# Altium schematic sheet USB2UART.SchDoc
size A4
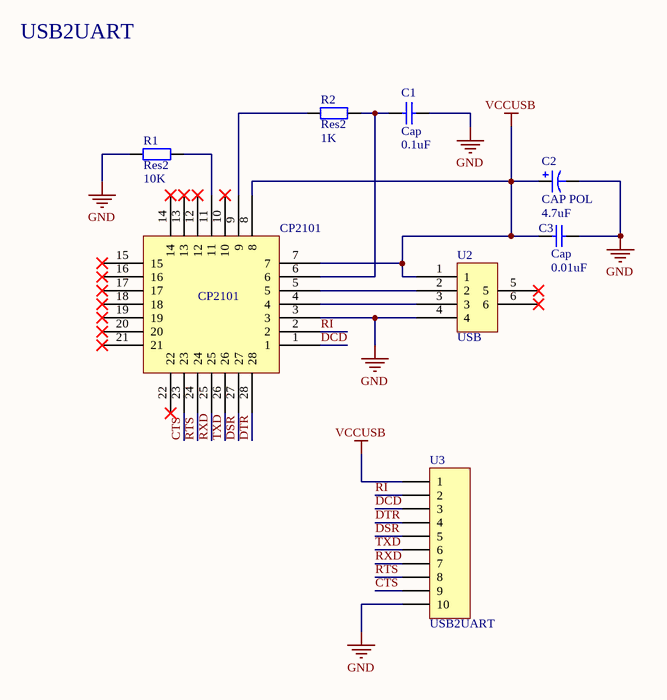
[diagram p0: USB2UART.SchDoc]

## Parts
?  CP2101
C1  Cap  value 0.1uF  [RAD-0.3]
C2  CAP POL  value 4.7uF  [CAP-LED]
C3  Cap  value 0.01uF  [RAD-0.3]
R1  Res2  value 10K  [AXIAL-0.4]
R2  Res2  value 1K  [AXIAL-0.4]
U2  USB
U3  USB2UART  [HDR1X10]

## Nets
GND: ?.3 C1.2 C2.2 C3.2 R1.1 U2.4 U3.10
VCCUSB: ?.7 ?.8 C2.1 C3.1 U2.1 U3.1
CTS: ?.23 U3.9
DCD: ?.1 U3.3
DSR: ?.27 U3.5
DTR: ?.28 U3.4
RI: ?.2 U3.2
RTS: ?.24 U3.8
RXD: ?.25 U3.7
TXD: ?.26 U3.6
Net?_4: ?.4 U2.3
Net?_5: ?.5 U2.2
Net?_6: ?.6 C1.1 R2.2
Net?_9: ?.9 R2.1
Net?_11: ?.11 R1.2

Not connected (* = marked no-connect by the designer): ? 10* 12* 13* 14* 15* 16* 17* 18* 19* 20* 21* 22*; U2 5* 6*

## Notes on the sheet
- USB2UART

## Library data of the parts
? = Component_1
C1 C3 = Cap: Capacitor; Published: 8-Jun-2000; LatestRevisionDate: 17-Jul-2002; LatestRevisionNote: Re-released for DXP Platform.; PackageReference: RAD-0.3; Publisher: Altium Limited
C2 = CAP POL: Polarized Capacitor (Axial); Published: 8-Jun-2000; LatestRevisionDate: 17-Jul-2002; LatestRevisionNote: Re-released for DXP Platform.; Publisher: Altium Limited
R1 R2 = Res2: Resistor; Published: 8-Jun-2000; LatestRevisionDate: 17-Jul-2002; LatestRevisionNote: Re-released for DXP Platform.; PackageReference: AXIAL-0.4; Publisher: Altium Limited
U3 = Header 10: Header, 10-Pin; LatestRevisionDate: 17-Jul-2002; LatestRevisionNote: Re-released for DXP Platform.; Publisher: Altium Limited